# EAGLE design GT-2022-001 (EAGLE 9.6.2)
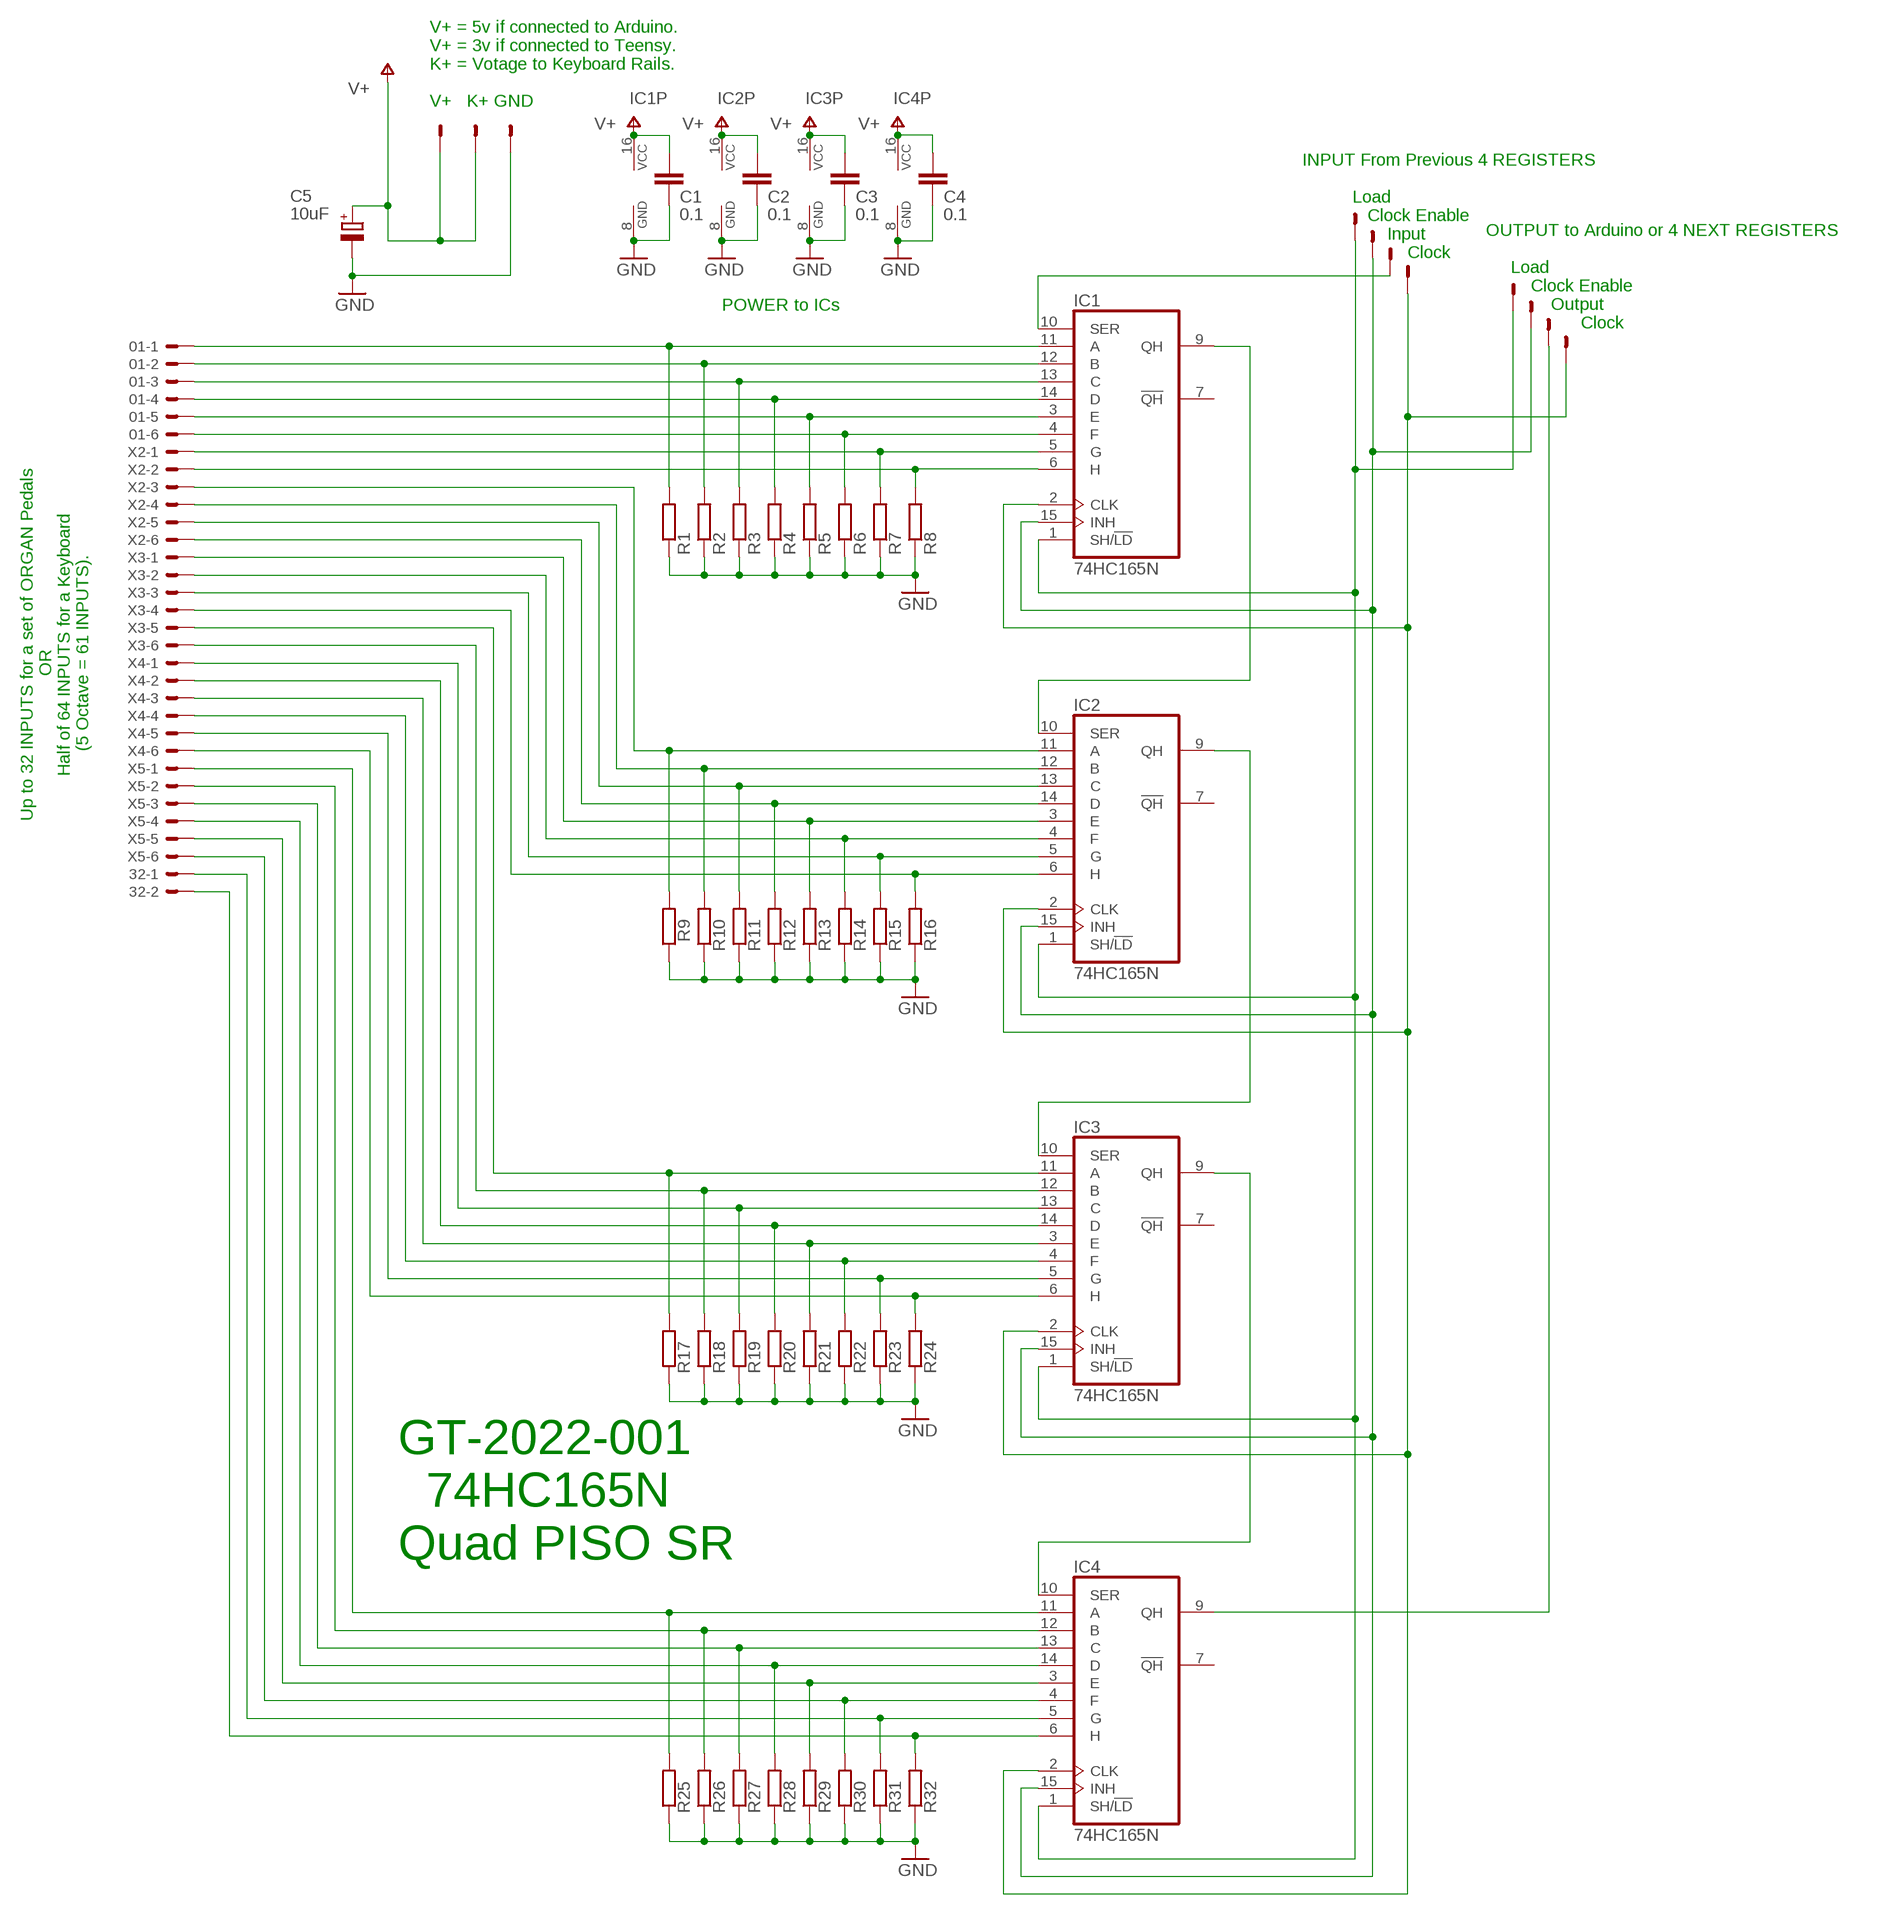
[diagram p0: schematic, sheet 1]

## Parts
01  22-23-2061  [22-23-2061]
32  22-23-2021  [22-23-2021]
C1  0.1  C-EU025-025X050  [C025-025X050]
C2  0.1  C-EU025-025X050  [C025-025X050]
C3  0.1  C-EU025-025X050  [C025-025X050]
C4  0.1  C-EU025-025X050  [C025-025X050]
C5  10uF  CPOL-EUE2.5-7  [E2,5-7]
IC1  74HC165N  [DIL16]
IC2  74HC165N  [DIL16]
IC3  74HC165N  [DIL16]
IC4  74HC165N  [DIL16]
LD_CE_IN_CK  22-23-2041  [22-23-2041]
LD_CE_OUT_CLK  22-23-2041  [22-23-2041]
R1  R-EU_0204/7  [0204/7]
R2  R-EU_0204/7  [0204/7]
R3  R-EU_0204/7  [0204/7]
R4  R-EU_0204/7  [0204/7]
R5  R-EU_0204/7  [0204/7]
R6  R-EU_0204/7  [0204/7]
R7  R-EU_0204/7  [0204/7]
R8  R-EU_0204/7  [0204/7]
R9  R-EU_0204/7  [0204/7]
R10  R-EU_0204/7  [0204/7]
R11  R-EU_0204/7  [0204/7]
R12  R-EU_0204/7  [0204/7]
R13  R-EU_0204/7  [0204/7]
R14  R-EU_0204/7  [0204/7]
R15  R-EU_0204/7  [0204/7]
R16  R-EU_0204/7  [0204/7]
R17  R-EU_0204/7  [0204/7]
R18  R-EU_0204/7  [0204/7]
R19  R-EU_0204/7  [0204/7]
R20  R-EU_0204/7  [0204/7]
R21  R-EU_0204/7  [0204/7]
R22  R-EU_0204/7  [0204/7]
R23  R-EU_0204/7  [0204/7]
R24  R-EU_0204/7  [0204/7]
R25  R-EU_0204/7  [0204/7]
R26  R-EU_0204/7  [0204/7]
R27  R-EU_0204/7  [0204/7]
R28  R-EU_0204/7  [0204/7]
R29  R-EU_0204/7  [0204/7]
R30  R-EU_0204/7  [0204/7]
R31  R-EU_0204/7  [0204/7]
R32  R-EU_0204/7  [0204/7]
V+_K+_GND  22-23-2031  [22-23-2031]
X2  22-23-2061  [22-23-2061]
X3  22-23-2061  [22-23-2061]
X4  22-23-2061  [22-23-2061]
X5  22-23-2061  [22-23-2061]

## Nets
GND: C1.2 C2.2 C3.2 C4.2 C5.- IC1.8(GND) IC2.8(GND) IC3.8(GND) IC4.8(GND) R1.1 R2.1 R3.1 R4.1 R5.1 R6.1 R7.1 R8.1 R9.1 R10.1 R11.1 R12.1 R13.1 R14.1 R15.1 R16.1 R17.1 R18.1 R19.1 R20.1 R21.1 R22.1 R23.1 R24.1 R25.1 R26.1 R27.1 R28.1 R29.1 R30.1 R31.1 R32.1 V+_K+_GND.3
N$2: IC1.5(G) R7.2 X2.1
N$3: 01.6 IC1.4(F) R6.2
N$4: 01.5 IC1.3(E) R5.2
N$5: 01.4 IC1.14(D) R4.2
N$6: 01.3 IC1.13(C) R3.2
N$7: 01.2 IC1.12(B) R2.2
N$8: 01.1 IC1.11(A) R1.2
N$9: IC2.6(H) R16.2 X3.4
N$10: IC4.4(F) R30.2 X5.6
N$11: IC3.12(B) R18.2 X3.6
N$12: IC3.11(A) R17.2 X3.5
N$13: IC4.14(D) R28.2 X5.4
N$14: IC1.1(SH/!LD) IC2.1(SH/!LD) IC3.1(SH/!LD) IC4.1(SH/!LD) LD_CE_IN_CK.1 LD_CE_OUT_CLK.1
N$15: IC1.2(CLK) IC2.2(CLK) IC3.2(CLK) IC4.2(CLK) LD_CE_IN_CK.4 LD_CE_OUT_CLK.4
N$16: IC1.10(SER) LD_CE_IN_CK.3
N$17: IC4.9(QH) LD_CE_OUT_CLK.3
N$18: IC4.11(A) R25.2 X5.1
N$19: IC1.6(H) R8.2 X2.2
N$21: IC1.9(QH) IC2.10(SER)
N$22: IC2.9(QH) IC3.10(SER)
N$23: IC1.15(INH) IC2.15(INH) IC3.15(INH) IC4.15(INH) LD_CE_IN_CK.2 LD_CE_OUT_CLK.2
N$24: IC3.9(QH) IC4.10(SER)
N$25: IC2.5(G) R15.2 X3.3
N$26: 32.1 IC4.5(G) R31.2
N$27: IC4.3(E) R29.2 X5.5
N$29: IC4.13(C) R27.2 X5.3
N$30: IC4.12(B) R26.2 X5.2
N$31: IC2.4(F) R14.2 X3.2
N$32: IC3.6(H) R24.2 X4.6
N$33: IC2.3(E) R13.2 X3.1
N$34: IC2.14(D) R12.2 X2.6
N$35: IC2.13(C) R11.2 X2.5
N$36: 32.2 IC4.6(H) R32.2
N$37: IC2.12(B) R10.2 X2.4
N$38: IC2.11(A) R9.2 X2.3
N$39: IC3.5(G) R23.2 X4.5
N$40: IC3.3(E) R21.2 X4.3
N$41: IC3.14(D) R20.2 X4.2
N$42: IC3.13(C) R19.2 X4.1
N$46: IC3.4(F) R22.2 X4.4
V+: C1.1 C2.1 C3.1 C4.1 C5.+ IC1.16(VCC) IC2.16(VCC) IC3.16(VCC) IC4.16(VCC) V+_K+_GND.1 V+_K+_GND.2
Unconnected: IC1.7(!QH) IC2.7(!QH) IC3.7(!QH) IC4.7(!QH)

## Notes on the sheet
- V+ = 5v if connected to Arduino.
  V+ = 3v if connected to Teensy.
  K+ = Votage to Keyboard Rails.
  
  V+   K+ GND
- INPUT From Previous 4 REGISTERS
  
            Load 
               Clock Enable 
                   Input 
                       Clock
- POWER to ICs
- OUTPUT to Arduino or 4 NEXT REGISTERS
  
            Load 
                Clock Enable 
                    Output 
                          Clock
- Up to 32 INPUTS for a set of ORGAN Pedals
                               OR
           Half of 64 INPUTS for a Keyboard
                (5 Octave = 61 INPUTS).
- GT-2022-001
      74HC165N
    Quad PISO SR

## Library data of the parts
01 X2-X5 = con-molex:22-23-2061: .100" (2.54mm) Center Header - 6 Pin; MF: MOLEX; MPN: 22-23-2061; OC_FARNELL: 1462922; OC_NEWARK: 27C1933
32 = con-molex:22-23-2021: .100" (2.54mm) Center Header - 2 Pin; MF: MOLEX; MPN: 22-23-2021; OC_FARNELL: 1462926; OC_NEWARK: 25C3832
C1-C4 = rcl:C-EU: CAPACITOR, European symbol; SPICEPREFIX: C
C5 = rcl:CPOL-EU: POLARIZED CAPACITOR, European symbol; SPICEPREFIX: C
IC1-IC4 = 74xx-eu:74*165: 8-bit parallel load SHIFT REGISTER
LD_CE_IN_CK LD_CE_OUT_CLK = con-molex:22-23-2041: .100" (2.54mm) Center Header - 4 Pin; MF: MOLEX; MPN: 22-23-2041; OC_FARNELL: 1462920; OC_NEWARK: 38C0355
R1-R32 = rcl:R-EU_: RESISTOR, European symbol; SPICEPREFIX: R
V+_K+_GND = con-molex:22-23-2031: .100" (2.54mm) Center Header - 3 Pin; MF: MOLEX; MPN: 22-23-2031; OC_FARNELL: 1462950; OC_NEWARK: 30C0862

## Board
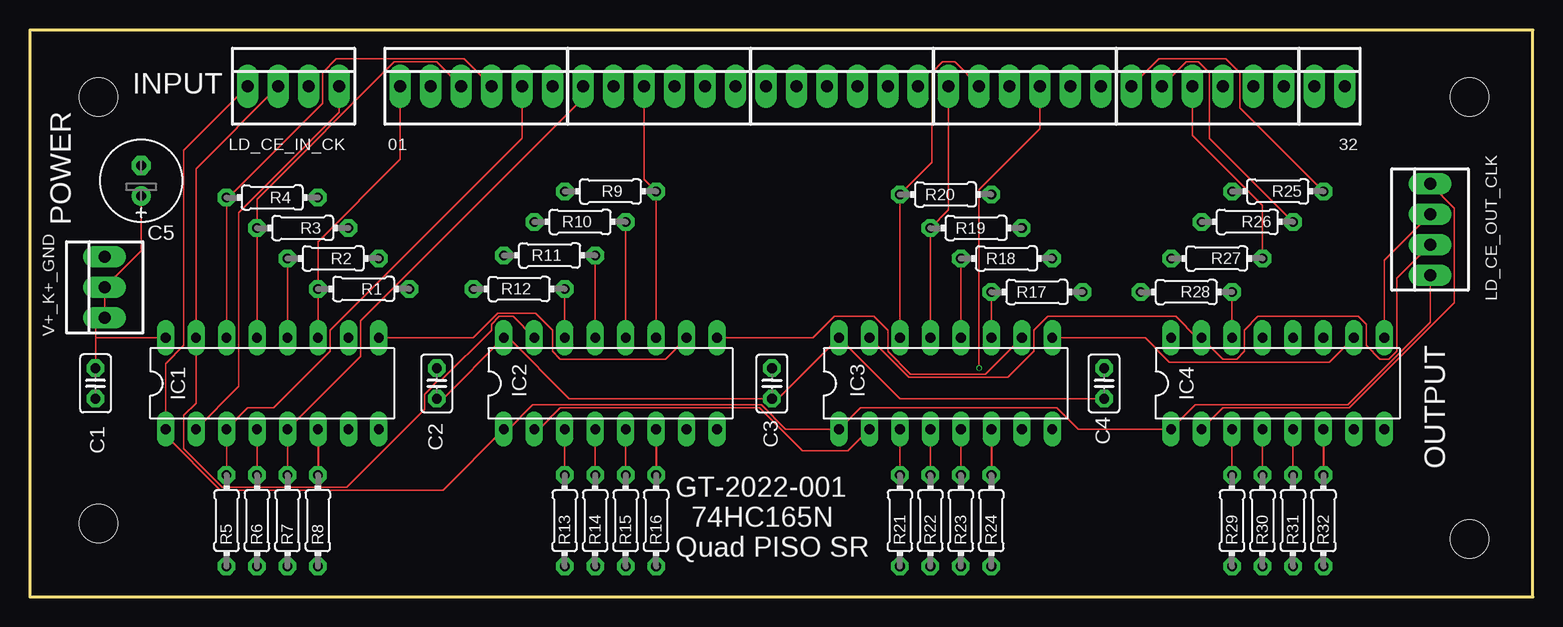
[diagram p1: board, top side]
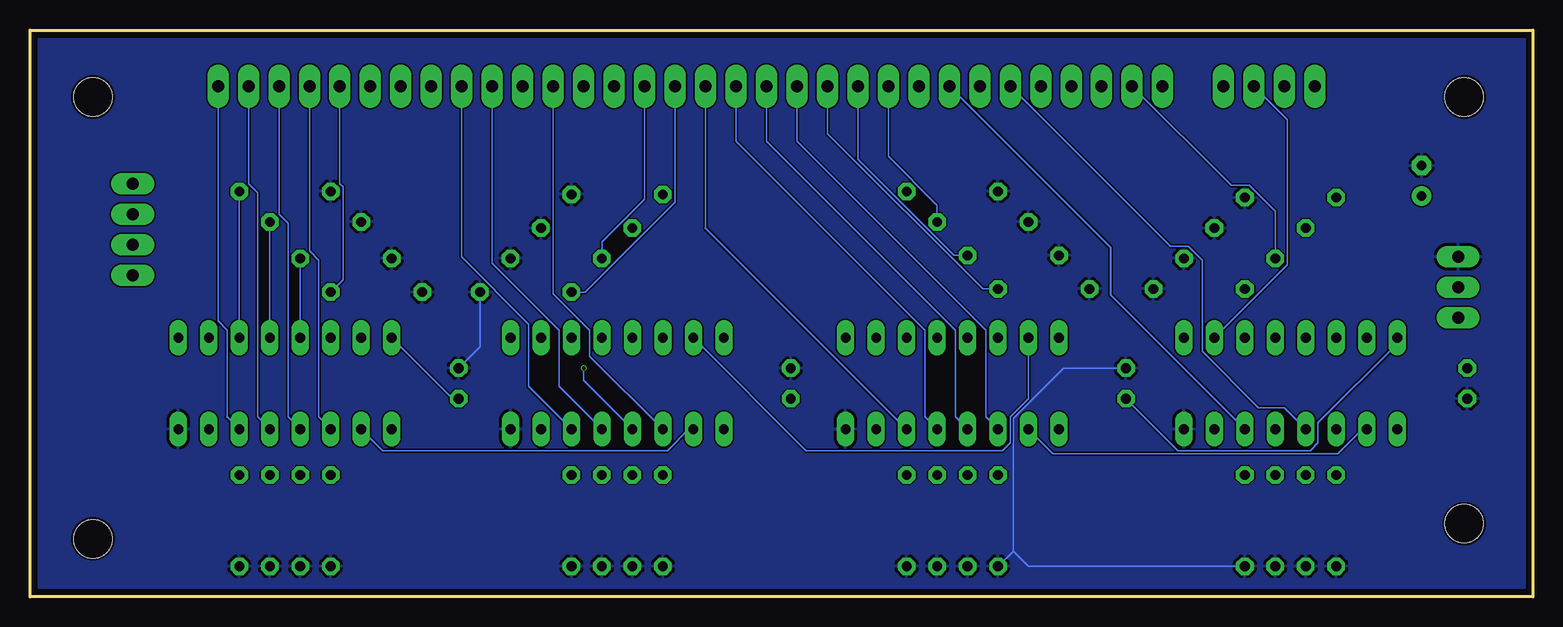
[diagram p2: board, bottom side, seen from below]

Size 125.27 x 47.23 mm. Coordinates in mm from the lower left corner, seen from the top.
Outline: 0,0 125.27,0 125.27,47.23 0,47.23 0,0
Copper layers (1*16): Top 0.035mm / dielectric 1.6mm / Bottom 0.035mm
Design rules "jlcpcb-2layers": minimum track width 5mil, minimum drill 0.3mm, track to track 5mil, track to pad 5mil, pad to pad 5mil, via to via 5mil, smd to smd 5mil, copper to edge 0.2mm, drill to drill 6mil, minimum pad ring 10mil, minimum via ring 3mil, stop-mask expansion 4mil, vias tented up to drill 0mil, thermal gap 10mil
Holes 3.2 mm at 5.71,41.66 5.71,6.1 120.02,4.83 120.02,41.66

### Footprints (pad centres in the part's own frame; a part is rotated, then mirrored left to right if it is on the bottom)
22-23-2061 = drill 1 long: 1 -6.35,0; 2 -3.81,0; 3 -1.27,0; 4 1.27,0; 5 3.81,0; 6 6.35,0
22-23-2021 = drill 1 long: 1 -1.27,0; 2 1.27,0
C025-025X050 = drill 0.813 octagon: 1 -1.27,0; 2 1.27,0
E2,5-7 = drill 0.813 pad 1.6: + -1.27,0 | drill 0.813 pad 1.6 octagon: - 1.27,0
DIL16 = drill 0.813 long: 1 -8.89,-3.81; 2 -6.35,-3.81; 3 -3.81,-3.81; 4 -1.27,-3.81; 5 1.27,-3.81; 6 3.81,-3.81; 7 6.35,-3.81; 8 8.89,-3.81; 9 8.89,3.81; 10 6.35,3.81; 11 3.81,3.81; 12 1.27,3.81; 13 -1.27,3.81; 14 -3.81,3.81; 15 -6.35,3.81; 16 -8.89,3.81
22-23-2041 = drill 1 long: 1 -3.81,0; 2 -1.27,0; 3 1.27,0; 4 3.81,0
0204/7 = drill 0.813 octagon: 1 -3.81,0; 2 3.81,0
22-23-2031 = drill 1 long: 1 -2.54,0; 2 0,0; 3 2.54,0

### Placement (x,y rotation side)
01  37.21,42.55 0 top
32  108.33,42.55 0 top
C1  5.46,17.78 270 top
C2  33.91,17.78 90 top
C3  61.85,17.78 90 top
C4  89.53,17.78 90 top
C5  9.27,34.67 90 top
IC1  20.19,17.78 0 top
IC2  48.39,17.78 0 top
IC3  76.33,17.78 0 top
IC4  104.01,17.78 0 top
LD_CE_IN_CK  21.97,42.55 0 top
LD_CE_OUT_CLK  116.71,30.61 90 top
R1  27.81,25.65 180 top
R2  25.27,28.19 180 top
R3  22.73,30.73 180 top
R4  20.19,33.27 180 top
R5  16.38,6.35 90 top
R6  18.92,6.35 90 top
R7  21.46,6.35 90 top
R8  24,6.35 90 top
R9  48.39,33.78 0 top
R10  45.85,31.24 0 top
R11  43.31,28.45 0 top
R12  40.77,25.65 0 top
R13  44.58,6.35 90 top
R14  47.12,6.35 90 top
R15  49.66,6.35 90 top
R16  52.2,6.35 90 top
R17  83.95,25.4 180 top
R18  81.41,28.19 180 top
R19  78.87,30.73 180 top
R20  76.33,33.53 180 top
R21  72.52,6.35 90 top
R22  75.06,6.35 90 top
R23  77.6,6.35 90 top
R24  80.14,6.35 90 top
R25  104.01,33.78 0 top
R26  101.47,31.24 0 top
R27  98.93,28.19 0 top
R28  96.39,25.4 0 top
R29  100.2,6.35 90 top
R30  102.74,6.35 90 top
R31  105.28,6.35 90 top
R32  107.82,6.35 90 top
V+_K+_GND  6.22,25.78 90 top
X2  52.45,42.55 0 top
X3  67.69,42.55 0 top
X4  82.93,42.55 0 top
X5  98.17,42.55 0 top

### Tracks (layer width: path | path; a pad name or v marks a point on that pad's centre or on a via)
GND
  Bottom 0.127: R17.1 87.76,20.83 C4.2 | C2.2 39.12,19.05 43.31,14.86 43.31,3.81 | R13.1 43.31,3.81 | R8.1 42.04,2.54 43.31,3.81
  pour Bottom: 124.59,46.48 124.59,0.76 0.63,0.76 0.63,46.48
N$2
  Top 0.127: R7.2 IC1.5 27.56,20.07 27.56,22.99 46.1,41.53 X2.1
N$3
  Top 0.127: IC1.4 R6.2
  Bottom 0.127: 01.6 30.23,29.21 28.7,29.21 27.56,28.07 27.56,20.45 22.86,15.75 20.7,15.75 IC1.4
N$4
  Top 0.127: R5.2 IC1.3 18.16,15.75 20.32,15.75 25.02,20.45 25.02,22.23 41.02,38.23 01.5
N$5
  Top 0.127: 16.38,33.15 IC1.14 | 01.4 36.2,44.83 25.53,44.83 24.38,43.69 24.38,41.15 16.38,33.15 | 16.38,33.15 R4.2
N$6
  Top 0.127: IC1.13 R3.2 18.92,33.15 30.35,44.58 33.91,44.58 01.3
N$7
  Top 0.127: R2.2 IC1.12
  Bottom 0.127: 01.2 25.15,34.29 23.62,34.29 21.46,32.13 R2.2
N$8
  Top 0.127: IC1.11 R1.2 24,29.59 30.86,36.45 01.1
N$9
  Top 0.152: IC2.6 R16.2
  Bottom 0.127: X3.4 68.96,30.73
  Bottom 0.152: 68.96,30.73 IC2.6
N$10
  Top 0.127: IC4.4 R30.2
  Bottom 0.127: X5.6 104.52,31.88 103.76,31.11 103.76,14.99 IC4.4
N$11
  Top 0.127: R18.2 IC3.12
  Bottom 0.127: X3.6 74.04,33.15 77.6,29.59 R18.2
N$12
  Top 0.127: R17.2 IC3.11
  Bottom 0.127: X3.5 71.5,32.89 78.99,25.4 R17.2
N$13
  Top 0.127: R28.2 IC4.14
  Bottom 0.127: X5.4 99.44,34.42 99.19,34.16 99.19,26.42 R28.2
N$14
  Top 0.127: LD_CE_IN_CK.1 12.83,37.21 12.83,20.95 11.3,19.43 IC1.1 11.3,13.46 15.87,8.89 34.42,8.89 IC2.1 39.88,13.97 41.91,16 60.96,16 62.99,13.97 IC3.1 69.22,15.75 85.6,15.75 87.38,13.97 IC4.1 97.16,16 109.85,16 116.71,22.86 LD_CE_OUT_CLK.1
N$15
  Top 0.127: LD_CE_IN_CK.4 25.78,40.39 17.4,32 17.4,17.53 IC1.2 | LD_CE_OUT_CLK.4 118.74,32.39 118.74,24.51 109.98,15.75 99.44,15.75 IC4.2 | IC2.2 42.42,13.97 44.2,15.75 60.83,15.75 64.39,12.19 68.2,12.19 IC3.2
  Bottom 0.127: IC1.2 14.22,13.97 16.26,11.94 40,11.94 IC2.2 | IC3.2 70.36,13.97 72.14,12.19 95.88,12.19 IC4.2
N$16
  Bottom 0.127: IC1.10 20.45,27.69 20.45,39.75 LD_CE_IN_CK.3
N$17
  Top 0.127: IC4.9 112.9,28.07 LD_CE_OUT_CLK.3
N$18
  Top 0.127: X5.1 94.11,44.83 99.69,44.83 100.84,43.69 100.84,40.77 R25.2
  Bottom 0.127: R25.2 IC4.11
N$19
  Top 0.152: IC1.6 R8.2
  Bottom 0.152: IC1.6 35.18,25.15 35.18,29.08 X2.2
N$21
  Top 0.127: IC1.9 36.96,21.59 38.99,23.62 42.16,23.62 43.56,22.23 43.56,20.45 44.2,19.81 52.96,19.81 IC2.10
N$22
  Top 0.127: IC2.9 65.28,21.59 67.06,23.37 70.36,23.37 71.5,22.23 71.5,20.45 73.41,18.54 79.63,18.54 IC3.10
N$23
  Top 0.127: LD_CE_IN_CK.2 13.84,35.69 IC1.15 13.84,16.13 12.83,15.11 12.83,12.32 16,9.14 26.42,9.14 32.89,15.62 32.89,16.89 34.04,18.03 34.29,18.03 38.48,22.23 38.48,22.73 39.12,23.37 40.26,23.37 IC2.15 | IC3.15 73.28,18.29 81.53,18.29 83.69,20.45 83.69,22.23 84.84,23.37 95.5,23.37 97.28,21.59 IC4.15 99.44,19.81 100.58,19.81 101.22,20.45 101.22,22.23 102.36,23.37 110.74,23.37 111.38,22.73 111.38,20.95 112.52,19.81 113.28,19.81 113.92,20.45 113.92,26.54 LD_CE_OUT_CLK.2
  Bottom 0.127: IC2.15 42.04,16.51 43.56,14.99 43.56,12.83 44.2,12.19 60.58,12.19 IC3.15
N$24
  Top 0.127: IC3.9 92.96,21.59 95,19.56 108.33,19.56 IC4.10
N$25
  Top 0.127: IC2.5 R15.2
  Bottom 0.127: X3.3 66.42,37.97 50.67,22.23 50.67,14.99 IC2.5
N$26
  Top 0.127: IC4.5 R31.2
  Bottom 0.127: 32.1 107.06,34.42 106.3,33.66 106.3,14.99 IC4.5
N$27
  Top 0.127: IC4.3 R29.2
  Bottom 0.127: X5.5 101.98,28.83 101.22,28.07 101.22,14.99 IC4.3
N$29
  Top 0.127: X5.3 96.9,38.48 102.74,32.64 R27.2
  Bottom 0.127: R27.2 IC4.13
N$30
  Top 0.127: X5.2 96.39,44.58 97.41,44.58 98.3,43.69 98.3,38.23 R26.2
  Bottom 0.127: R26.2 IC4.12
N$31
  Top 0.127: IC2.4 R14.2
  Bottom 0.127: X3.2 63.88,37.97 48.13,22.23 48.13,14.99 IC2.4
N$32
  Top 0.152: IC3.6 R24.2
  Bottom 0.127: X4.6 89.28,28.32 83.69,22.73 83.69,17.53
  Bottom 0.152: 83.69,17.53 IC3.6
N$33
  Top 0.127: IC2.3 R13.2
  Bottom 0.127: X3.1 61.34,37.97 45.59,22.23 45.59,14.99 IC2.3
N$34
  Top 0.127: R12.2 IC2.14
  Bottom 0.127: X2.6 58.8,38.61 45.85,25.65 R12.2
N$35
  Top 0.127: R11.2 IC2.13
  Bottom 0.127: X2.5 56.26,36.45 48.26,28.45 R11.2
N$36
  Top 0.152: IC4.6 R32.2
  Bottom 0.127: 32.2 109.6,22.99 108.84,22.23 108.84,14.99
  Bottom 0.152: IC4.6 108.84,14.99
N$37
  Top 0.127: R10.2 IC2.12
  Bottom 0.127: X2.4 53.72,36.7 49.66,32.64 R10.2
N$38
  Top 0.127: IC2.11 R9.2 51.18,34.8 X2.3
N$39
  Top 0.127: IC3.5 R23.2
  Bottom 0.127: X4.5 86.74,27.81 81.15,22.23 81.15,17.53 IC3.5
N$40
  Top 0.127: IC3.3 R21.2
  Bottom 0.127: X4.3 81.66,25.27 78.61,22.23 78.61,20.07 IC3.3
N$41
  Top 0.127: IC3.14 R20.2 75.18,36.19 75.18,43.69 76.07,44.58 77.09,44.58 X4.2
N$42
  Top 0.127: IC3.13 R19.2 76.58,32.26 X4.1
N$46  (via drill 0.3)
  Top 0.127: IC3.4 R22.2 | X4.4 84.2,38.99 79.12,33.91 v79.12,19.05
  Bottom 0.127: v79.12,19.05 79.12,18.03 IC3.4
V+
  Top 0.127: C5.+ 9.27,28.83 V+_K+_GND.2 V+_K+_GND.1 | 5.46,22.48 5.46,21.59 | 5.46,21.59 C1.1 | 5.46,21.59 IC1.16 | C2.1 34.42,16.51 IC2.16 | IC3.16 62.36,16.51 C3.1 44.96,16.51 39.88,21.59 | 72.52,16.51 C4.1
  Top 0.152: V+_K+_GND.1 5.46,22.48 | IC3.16 72.52,16.51 | IC2.16 39.88,21.59
  Bottom 0.127: 17.91,14.5 17.91,12.83 18.54,12.19 29.59,12.19 C2.1 | C4.1 90.04,16.51 IC4.16
  Bottom 0.152: 17.91,14.5 11.3,21.1 IC1.16

### Text on the board
tNames: INPUT | POWER | OUTPUT | GT-2022-001 / 74HC165N / Quad PISO SR